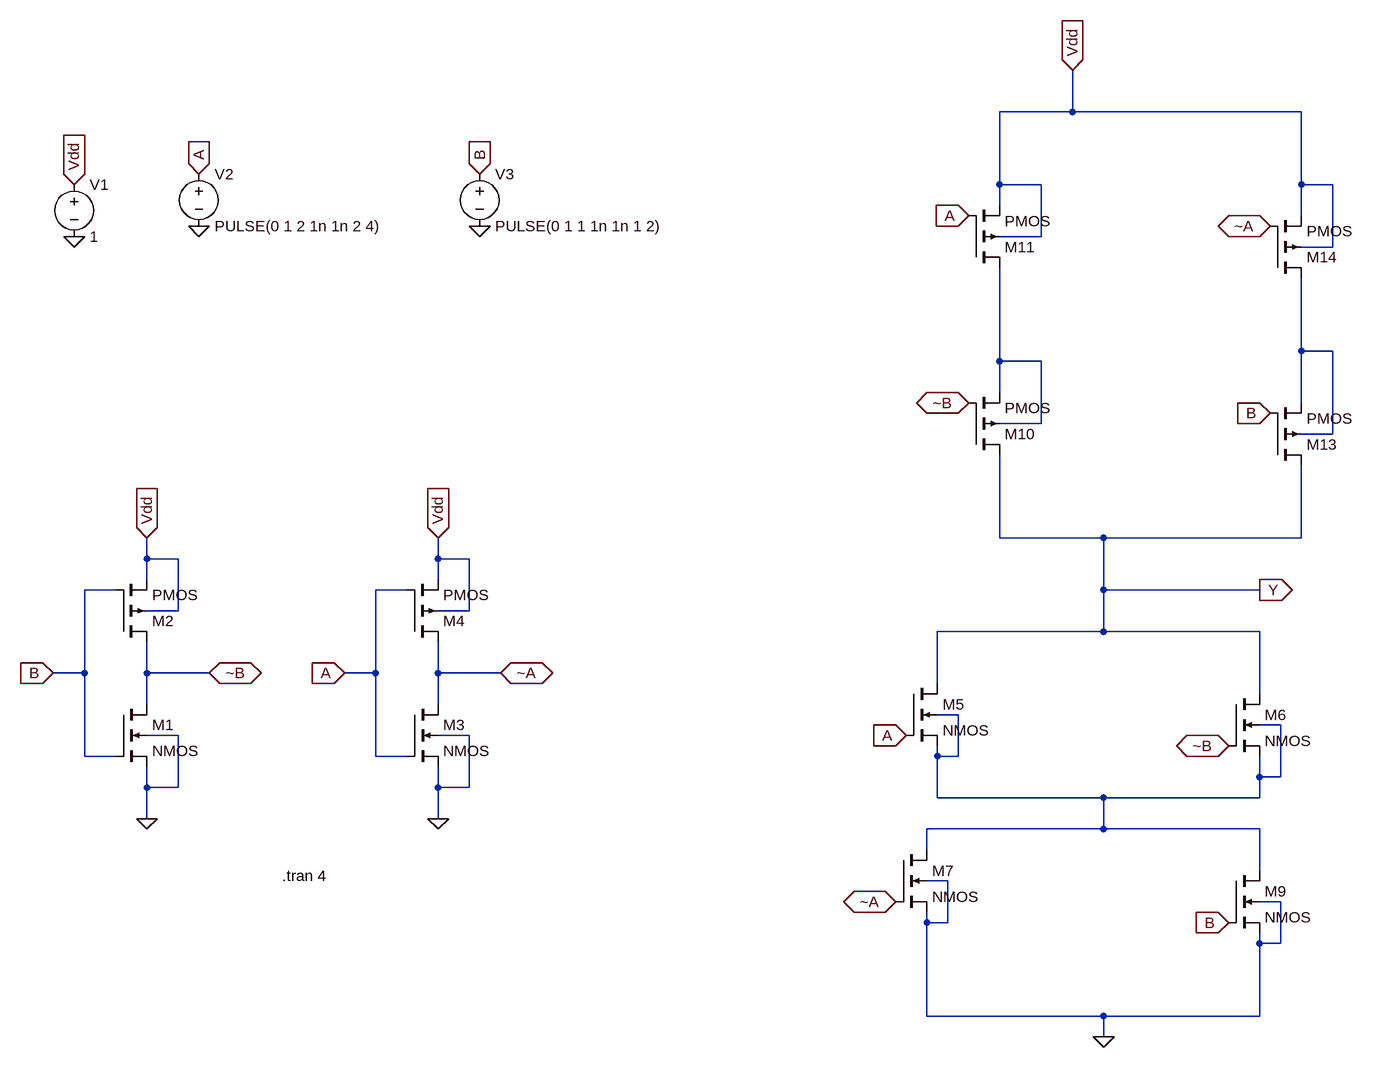
[diagram p0: schematic xor.asc]
xor.asc, the LTspice schematic file:
Version 4
SHEET 1 880 1108
WIRE 352 -368 352 -432
WIRE 352 -368 240 -368
WIRE 704 -368 352 -368
WIRE 240 -256 240 -368
WIRE 304 -256 240 -256
WIRE 704 -256 704 -368
WIRE 752 -256 704 -256
WIRE 240 -224 240 -256
WIRE 704 -208 704 -256
WIRE 304 -176 304 -256
WIRE 304 -176 240 -176
WIRE 752 -160 752 -256
WIRE 752 -160 704 -160
WIRE 704 0 704 -112
WIRE 752 0 704 0
WIRE 240 16 240 -128
WIRE 304 16 240 16
WIRE 240 64 240 16
WIRE 704 80 704 0
WIRE 304 112 304 16
WIRE 304 112 240 112
WIRE 752 128 752 0
WIRE 752 128 704 128
WIRE 240 288 240 160
WIRE 400 288 240 288
WIRE 704 288 704 176
WIRE 704 288 400 288
WIRE -1072 320 -1072 288
WIRE -1024 320 -1072 320
WIRE -624 320 -624 288
WIRE -576 320 -624 320
WIRE -1072 352 -1072 320
WIRE -624 352 -624 320
WIRE -1120 368 -1168 368
WIRE -672 368 -720 368
WIRE 400 368 400 288
WIRE 640 368 400 368
WIRE -1024 400 -1024 320
WIRE -1024 400 -1072 400
WIRE -576 400 -576 320
WIRE -576 400 -624 400
WIRE 400 432 400 368
WIRE 400 432 144 432
WIRE 640 432 400 432
WIRE -1168 496 -1168 368
WIRE -1168 496 -1216 496
WIRE -1072 496 -1072 448
WIRE -976 496 -1072 496
WIRE -720 496 -720 368
WIRE -720 496 -768 496
WIRE -624 496 -624 448
WIRE -528 496 -624 496
WIRE 144 512 144 432
WIRE 640 528 640 432
WIRE -1072 544 -1072 496
WIRE -624 544 -624 496
WIRE 176 560 144 560
WIRE 672 576 640 576
WIRE -1024 592 -1072 592
WIRE -576 592 -624 592
WIRE -1168 624 -1168 496
WIRE -1120 624 -1168 624
WIRE -720 624 -720 496
WIRE -672 624 -720 624
WIRE 144 624 144 608
WIRE 176 624 176 560
WIRE 176 624 144 624
WIRE 640 656 640 624
WIRE 672 656 672 576
WIRE 672 656 640 656
WIRE -1072 672 -1072 640
WIRE -1024 672 -1024 592
WIRE -1024 672 -1072 672
WIRE -624 672 -624 640
WIRE -576 672 -576 592
WIRE -576 672 -624 672
WIRE 144 688 144 624
WIRE 400 688 144 688
WIRE 640 688 640 656
WIRE 640 688 400 688
WIRE -1072 720 -1072 672
WIRE -624 720 -624 672
WIRE 400 736 400 688
WIRE 400 736 128 736
WIRE 640 736 400 736
WIRE 128 768 128 736
WIRE 640 800 640 736
WIRE 160 816 128 816
WIRE 672 848 640 848
WIRE 128 880 128 864
WIRE 160 880 160 816
WIRE 160 880 128 880
WIRE 640 912 640 896
WIRE 672 912 672 848
WIRE 672 912 640 912
WIRE 128 1024 128 880
WIRE 400 1024 128 1024
WIRE 640 1024 640 912
WIRE 640 1024 400 1024
WIRE 400 1056 400 1024
FLAG 352 -432 Vdd
IOPIN 352 -432 In
FLAG 640 368 Y
IOPIN 640 368 Out
FLAG -1184 -256 Vdd
IOPIN -1184 -256 In
FLAG -1184 -176 0
FLAG -992 -192 0
FLAG -560 -192 0
FLAG -992 -272 A
IOPIN -992 -272 In
FLAG -560 -272 B
IOPIN -560 -272 In
FLAG -1072 720 0
FLAG -1072 288 Vdd
IOPIN -1072 288 In
FLAG -1216 496 B
IOPIN -1216 496 In
FLAG -976 496 ~B
IOPIN -976 496 BiDir
FLAG -624 720 0
FLAG -624 288 Vdd
IOPIN -624 288 In
FLAG -768 496 A
IOPIN -768 496 In
FLAG -528 496 ~A
IOPIN -528 496 BiDir
FLAG 96 592 A
IOPIN 96 592 In
FLAG 192 -208 A
IOPIN 192 -208 In
FLAG 592 608 ~B
IOPIN 592 608 BiDir
FLAG 192 80 ~B
IOPIN 192 80 BiDir
FLAG 80 848 ~A
IOPIN 80 848 BiDir
FLAG 656 96 B
IOPIN 656 96 In
FLAG 656 -192 ~A
IOPIN 656 -192 BiDir
FLAG 592 880 B
IOPIN 592 880 In
FLAG 400 1056 0
SYMBOL voltage -1184 -272 R0
WINDOW 123 0 0 Left 0
WINDOW 39 0 0 Left 0
SYMATTR InstName V1
SYMATTR Value 1
SYMBOL voltage -992 -288 R0
WINDOW 123 0 0 Left 0
WINDOW 39 0 0 Left 0
SYMATTR InstName V2
SYMATTR Value PULSE(0 1 2 1n 1n 2 4)
SYMBOL voltage -560 -288 R0
WINDOW 123 0 0 Left 0
WINDOW 39 0 0 Left 0
SYMATTR InstName V3
SYMATTR Value PULSE(0 1 1 1n 1n 1 2)
SYMBOL nmos4 -1120 544 R0
SYMATTR InstName M1
SYMBOL pmos4 -1120 448 M180
SYMATTR InstName M2
SYMBOL nmos4 -672 544 R0
SYMATTR InstName M3
SYMBOL pmos4 -672 448 M180
SYMATTR InstName M4
SYMBOL nmos4 96 512 R0
SYMATTR InstName M5
SYMBOL nmos4 592 528 R0
SYMATTR InstName M6
SYMBOL nmos4 80 768 R0
SYMATTR InstName M7
SYMBOL pmos4 192 160 M180
SYMATTR InstName M10
SYMBOL pmos4 192 -128 M180
SYMATTR InstName M11
SYMBOL pmos4 656 176 M180
SYMATTR InstName M13
SYMBOL pmos4 656 -112 M180
SYMATTR InstName M14
SYMBOL nmos4 592 800 R0
SYMATTR InstName M9
TEXT -864 808 Left 2 !.tran 4

The netlist it stands for:
* xor.asc
V1 Vdd 0 1
V2 A 0 PULSE(0 1 2 1n 1n 2 4)
V3 B 0 PULSE(0 1 1 1n 1n 1 2)
M1 ~B B 0 0 NMOS
M2 ~B B Vdd Vdd PMOS
M3 ~A A 0 0 NMOS
M4 ~A A Vdd Vdd PMOS
M5 Y A N003 N003 NMOS
M6 Y ~B N003 N003 NMOS
M7 N003 ~A 0 0 NMOS
M10 Y ~B N002 N002 PMOS
M11 N002 A Vdd Vdd PMOS
M13 Y B N001 N001 PMOS
M14 N001 ~A Vdd Vdd PMOS
M9 N003 B 0 0 NMOS
.model NMOS NMOS
.model PMOS PMOS
.lib standard.mos
.tran 4
.backanno
.end

* Results of the author's LTspice run, read from the files saved beside the schematic
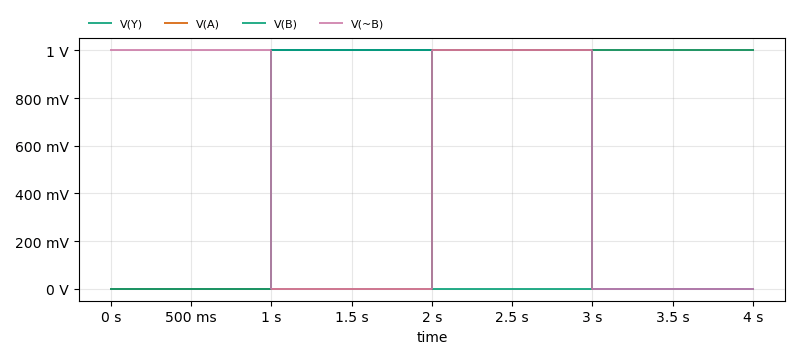
[diagram p1: Transient Analysis of xor.asc, plotted from the saved traces]
* Transient Analysis, 1 run:
*   V(Y): min 401.9 nV, max 1 V, average 500 mV, rms 707.1 mV, last 401.9 nV
*   V(A): min 0 V, max 1 V, average 500 mV, rms 707.1 mV, last 1 V
*   V(B): min 0 V, max 1 V, average 500 mV, rms 707.1 mV, last 1 V
*   V(~B): min 0 V, max 1 V, average 500 mV, rms 707.1 mV, last 100.5 nV